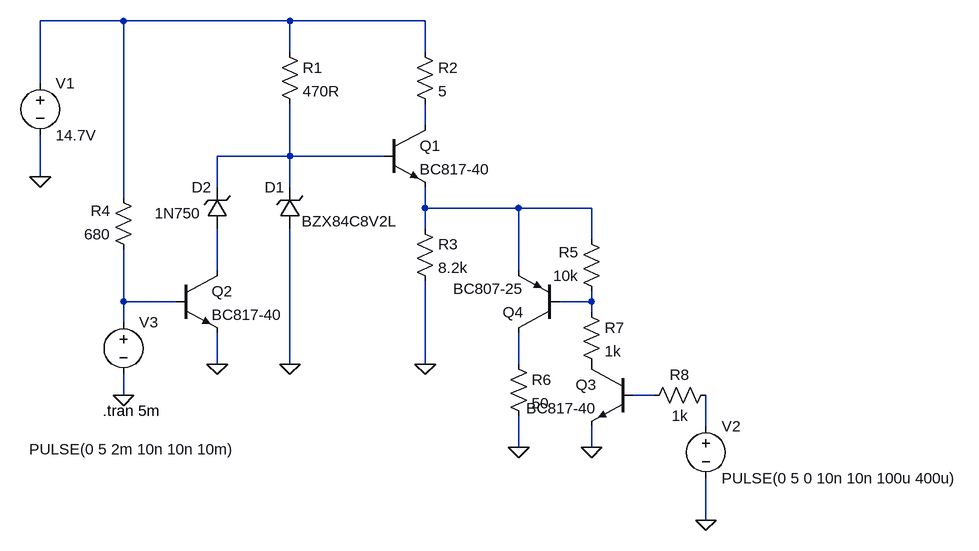
[diagram p0: schematic hv_prog_zener.asc]
hv_prog_zener.asc, the LTspice schematic file:
Version 4
SHEET 1 1464 680
WIRE -80 -160 -208 -160
WIRE 176 -160 -80 -160
WIRE 384 -160 176 -160
WIRE 176 -112 176 -160
WIRE 384 -112 384 -160
WIRE -208 -64 -208 -160
WIRE 384 0 384 -32
WIRE 176 48 176 -32
WIRE 176 48 64 48
WIRE 320 48 176 48
WIRE -208 80 -208 16
WIRE 64 96 64 48
WIRE 176 96 176 48
WIRE -80 112 -80 -160
WIRE 384 128 384 96
WIRE 528 128 384 128
WIRE 640 128 528 128
WIRE 384 160 384 128
WIRE 640 176 640 128
WIRE 64 224 64 160
WIRE 528 224 528 128
WIRE -80 272 -80 192
WIRE 0 272 -80 272
WIRE 640 272 640 256
WIRE 640 272 592 272
WIRE 640 288 640 272
WIRE -80 304 -80 272
WIRE 64 368 64 320
WIRE 176 368 176 160
WIRE 384 368 384 240
WIRE 528 368 528 320
WIRE -80 416 -80 384
WIRE 736 416 704 416
WIRE 816 464 816 416
WIRE 528 496 528 448
WIRE 640 496 640 464
WIRE 816 608 816 544
FLAG 64 368 0
FLAG 176 368 0
FLAG 384 368 0
FLAG -208 80 0
FLAG 816 608 0
FLAG -80 416 0
FLAG 528 496 0
FLAG 640 496 0
SYMBOL zener 192 160 R180
WINDOW 0 24 64 Left 2
WINDOW 3 -149 12 Left 2
SYMATTR InstName D1
SYMATTR Value BZX84C8V2L
SYMBOL zener 80 160 R180
WINDOW 0 24 64 Left 2
WINDOW 3 41 24 Left 2
SYMATTR InstName D2
SYMATTR Value 1N750
SYMBOL res 160 -128 R0
SYMATTR InstName R1
SYMATTR Value 470R
SYMBOL npn 320 0 R0
SYMATTR InstName Q1
SYMATTR Value BC817-40
SYMBOL res 368 -128 R0
SYMATTR InstName R2
SYMATTR Value 5
SYMBOL res 368 144 R0
SYMATTR InstName R3
SYMATTR Value 8.2k
SYMBOL voltage -208 -80 R0
WINDOW 123 0 0 Left 2
WINDOW 39 0 0 Left 2
SYMATTR InstName V1
SYMATTR Value 14.7V
SYMBOL npn 0 224 R0
SYMATTR InstName Q2
SYMATTR Value BC817-40
SYMBOL res -64 208 R180
WINDOW 0 36 76 Left 2
WINDOW 3 36 40 Left 2
SYMATTR InstName R4
SYMATTR Value 680
SYMBOL voltage 816 448 R0
WINDOW 123 0 0 Left 2
WINDOW 39 0 0 Left 2
SYMATTR InstName V2
SYMATTR Value PULSE(0 5 0 10n 10n 100u 400u)
SYMBOL voltage -80 288 R0
WINDOW 3 -145 211 Left 2
WINDOW 123 0 0 Left 2
WINDOW 39 0 0 Left 2
SYMATTR Value PULSE(0 5 2m 10n 10n 10m)
SYMATTR InstName V3
SYMBOL pnp 592 320 R180
SYMATTR InstName Q4
SYMATTR Value BC807-25
SYMBOL res 512 352 R0
SYMATTR InstName R6
SYMATTR Value 50
SYMBOL res 656 272 R180
WINDOW 0 36 76 Left 2
WINDOW 3 36 40 Left 2
SYMATTR InstName R5
SYMATTR Value 10k
SYMBOL res 624 272 R0
SYMATTR InstName R7
SYMATTR Value 1k
SYMBOL npn 704 368 M0
SYMATTR InstName Q3
SYMATTR Value BC817-40
SYMBOL res 832 400 R90
WINDOW 0 0 56 VBottom 2
WINDOW 3 32 56 VTop 2
SYMATTR InstName R8
SYMATTR Value 1k
TEXT -112 440 Left 2 !.tran 5m

The netlist it stands for:
* hv_prog_zener.asc
D1 0 N003 BZX84C8V2L
D2 N005 N003 1N750
R1 N001 N003 470R
Q1 N002 N003 N004 0 BC817-40
R2 N001 N002 5
R3 N004 0 8.2k
V1 N001 0 14.7V
Q2 N005 N006 0 0 BC817-40
R4 N006 N001 680
V2 N010 0 PULSE(0 5 0 10n 10n 100u 400u)
V3 N006 0 PULSE(0 5 2m 10n 10n 10m)
Q4 N008 N007 N004 0 BC807-25
R6 N008 0 50
R5 N007 N004 10k
R7 N007 P001 1k
Q3 P001 N009 0 0 BC817-40
R8 N010 N009 1k
.model D D
.lib standard.dio
.model NPN NPN
.model PNP PNP
.lib standard.bjt
.tran 5m
.backanno
.end